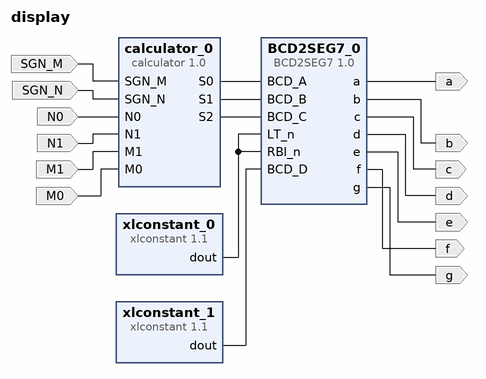
[diagram p0: block diagram of the top level]
# Vivado block design display, xc7a35tcpg236-1, Vivado 2016.3
create_bd_design display

create_bd_port -dir I SGN_M
create_bd_port -dir I SGN_N
create_bd_port -dir I N0
create_bd_port -dir I N1
create_bd_port -dir I M1
create_bd_port -dir I M0
create_bd_port -dir O a
create_bd_port -dir O b
create_bd_port -dir O c
create_bd_port -dir O d
create_bd_port -dir O e
create_bd_port -dir O f
create_bd_port -dir O g

create_bd_cell -type ip -vlnv xilinx.com:XUP:BCD2SEG7:1.0 BCD2SEG7_0
create_bd_cell -type ip -vlnv xilinx.com:ip:xlconstant:1.1 xlconstant_0
create_bd_cell -type ip -vlnv xilinx.com:ip:xlconstant:1.1 xlconstant_1
set_property -dict {CONFIG.CONST_VAL 0} [get_bd_cells xlconstant_1]
create_bd_cell -type ip -vlnv xilinx.com:user:calculator:1.0 calculator_0

# ---- connections ----

connect_bd_net [get_bd_ports SGN_M] [get_bd_pins calculator_0/SGN_M]
connect_bd_net [get_bd_ports SGN_N] [get_bd_pins calculator_0/SGN_N]
connect_bd_net -net N0_1 [get_bd_ports N0] [get_bd_pins calculator_0/N0]
connect_bd_net -net N1_1 [get_bd_ports N1] [get_bd_pins calculator_0/N1]
connect_bd_net -net M1_1 [get_bd_ports M1] [get_bd_pins calculator_0/M1]
connect_bd_net -net M0_1 [get_bd_ports M0] [get_bd_pins calculator_0/M0]
connect_bd_net [get_bd_pins calculator_0/S0] [get_bd_pins BCD2SEG7_0/BCD_A]
connect_bd_net [get_bd_pins calculator_0/S1] [get_bd_pins BCD2SEG7_0/BCD_B]
connect_bd_net [get_bd_pins calculator_0/S2] [get_bd_pins BCD2SEG7_0/BCD_C]
connect_bd_net [get_bd_pins xlconstant_0/dout] [get_bd_pins BCD2SEG7_0/LT_n] [get_bd_pins BCD2SEG7_0/RBI_n]
connect_bd_net [get_bd_pins xlconstant_1/dout] [get_bd_pins BCD2SEG7_0/BCD_D]
connect_bd_net [get_bd_pins BCD2SEG7_0/a] [get_bd_ports a]
connect_bd_net [get_bd_pins BCD2SEG7_0/b] [get_bd_ports b]
connect_bd_net [get_bd_pins BCD2SEG7_0/c] [get_bd_ports c]
connect_bd_net [get_bd_pins BCD2SEG7_0/d] [get_bd_ports d]
connect_bd_net [get_bd_pins BCD2SEG7_0/e] [get_bd_ports e]
connect_bd_net [get_bd_pins BCD2SEG7_0/f] [get_bd_ports f]
connect_bd_net [get_bd_pins BCD2SEG7_0/g] [get_bd_ports g]

validate_bd_design
save_bd_design
